# Altium schematic sheet motherboard.SchDoc
size A
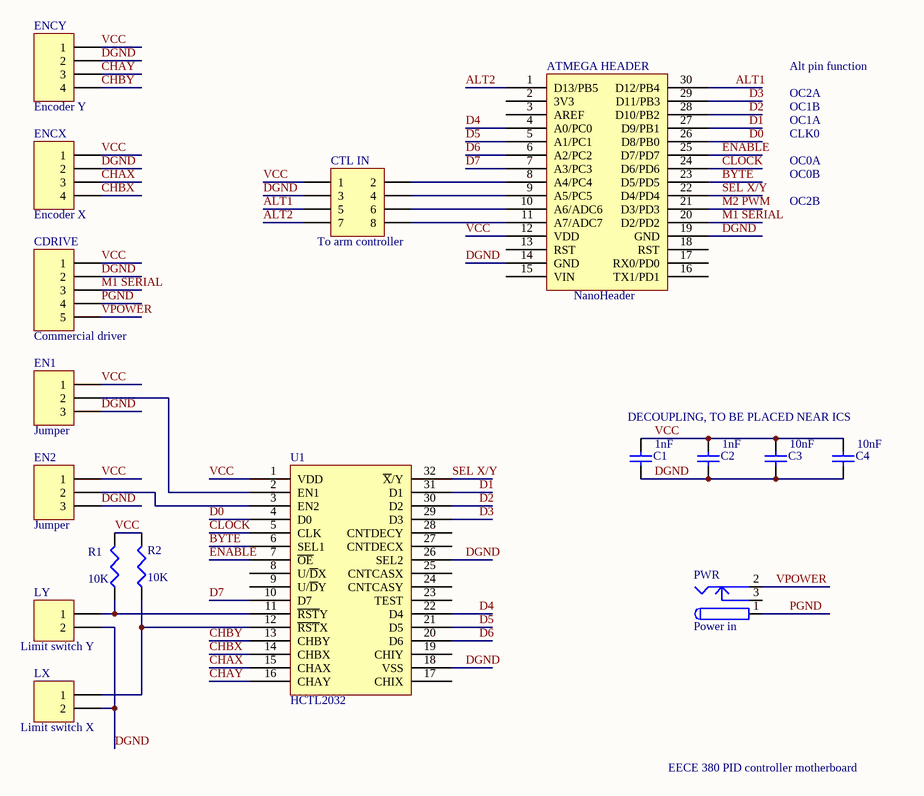
[diagram p0: motherboard.SchDoc]

## Parts
ATMEGA_HEADER  NanoHeader  [DIP30WIDE]
C1  value 1nF  [RAD-0.3]
C2  value 1nF  [RAD-0.3]
C3  value 10nF  [RAD-0.3]
C4  value 10nF  [RAD-0.3]
CDRIVE  Commercial driver  [HDR1X5_LGE1.0]
CTL_IN  To arm controller  [HDR2X4_LGE1.0]
EN1  Jumper  [HDR1X3_LGE1.0]
EN2  Jumper  [HDR1X3_LGE1.0]
ENCX  Encoder X  [HDR1X4_LGE1.0]
ENCY  Encoder Y  [HDR1X4_LGE1.0]
LX  Limit switch X  [HDR1X2_LGE1.0]
LY  Limit switch Y  [HDR1X2_LGE1.0]
PWR  Power in  [KLD_XLGE1.2]
R1  value 10K  [Res10mm_LGE1.0]
R2  value 10K  [Res10mm_LGE1.0]
U1  HCTL2032  [SOIC50P295X100-32L16N]

## Nets
ALT1: ATMEGA_HEADER.30(D12/PB4) CTL_IN.5
ALT2: ATMEGA_HEADER.1(D13/PB5) CTL_IN.7
BYTE: ATMEGA_HEADER.23(D5/PD5) U1.6(SEL1)
CHAX: ENCX.3 U1.15(CHAX)
CHAY: ENCY.3 U1.16(CHAY)
CHBX: ENCX.4 U1.14(CHBX)
CHBY: ENCY.4 U1.13(CHBY)
CLOCK: ATMEGA_HEADER.24(D6/PD6) U1.5(CLK)
D0: ATMEGA_HEADER.26(D8/PB0) U1.4(D0)
D1: ATMEGA_HEADER.27(D9/PB1) U1.31(D1)
D2: ATMEGA_HEADER.28(D10/PB2) U1.30(D2)
D3: ATMEGA_HEADER.29(D11/PB3) U1.29(D3)
D4: ATMEGA_HEADER.4(A0/PC0) U1.22(D4)
D5: ATMEGA_HEADER.5(A1/PC1) U1.21(D5)
D6: ATMEGA_HEADER.6(A2/PC2) U1.20(D6)
D7: ATMEGA_HEADER.7(A3/PC3) U1.10(D7)
DGND: ATMEGA_HEADER.14(GND) ATMEGA_HEADER.19(GND) C1.1 C2.1 C3.1 C4.1 CDRIVE.2 CTL_IN.3 EN1.3 EN2.3 ENCX.2 ENCY.2 LX.2 LY.2 U1.18(VSS) U1.26(SEL2)
ENABLE: ATMEGA_HEADER.25(D7/PD7) U1.7(~{OE})
M1 SERIAL: ATMEGA_HEADER.20(D2/PD2) CDRIVE.3
M2 PWM: ATMEGA_HEADER.21(D3/PD3)
PGND: CDRIVE.4 PWR.1
SEL X/Y: ATMEGA_HEADER.22(D4/PD4) U1.32(~{X}/Y)
VCC: ATMEGA_HEADER.12(VDD) C1.2 C2.2 C3.2 C4.2 CDRIVE.1 CTL_IN.1 EN1.1 EN2.1 ENCX.1 ENCY.1 R1.2 R2.2 U1.1(VDD)
VPOWER: CDRIVE.5 PWR.2
NetATMEGA_HEADER_8: ATMEGA_HEADER.8(A4/PC4) CTL_IN.2
NetATMEGA_HEADER_9: ATMEGA_HEADER.9(A5/PC5) CTL_IN.4
NetATMEGA_HEADER_10: ATMEGA_HEADER.10(A6/ADC6) CTL_IN.6
NetATMEGA_HEADER_11: ATMEGA_HEADER.11(A7/ADC7) CTL_IN.8
NetEN1_2: EN1.2 U1.2(EN1)
NetEN2_2: EN2.2 U1.3(EN2)
NetLX_1: LX.1 R2.1 U1.12(~{RST}X)
NetLY_1: LY.1 R1.1 U1.11(~{RST}Y)

Not connected (* = marked no-connect by the designer): ATMEGA_HEADER 2(3V3) 3(AREF) 13(RST) 15(VIN) 16(TX1/PD1) 17(RX0/PD0) 18(RST); PWR 3; U1 8(U/~{D}X) 9(U/~{D}Y) 17(CHIX) 19(CHIY) 23(TEST) 24(CNTCASY) 25(CNTCASX) 27(CNTDECX) 28(CNTDECY)

## Notes on the sheet
- OC2A
- Alt pin function
- OC0A
- CLK0
- OC1A
- OC1B
- OC0B
- OC2B
- DECOUPLING, TO BE PLACED NEAR ICS
- EECE 380 PID controller motherboard

## Library data of the parts
C1-C4 = Cap: Capacitor; Published: 8-Jun-2000; LatestRevisionDate: 17-Jul-2002; LatestRevisionNote: Re-released for DXP Platform.; PackageReference: RAD-0.3; Publisher: Altium Limited; PackageDescription: Radial Cap, Thru-Hole; 2 Leads; 0.3 in Pin Spacing
CDRIVE = C-Hdr1x5: Header, 6-Pin; LatestRevisionDate: 17-Jul-2002; LatestRevisionNote: Re-released for DXP Platform.; Publisher: Altium Limited
CTL_IN = C-Hdr2x4: Header, 4-Pin, Dual row; LatestRevisionDate: 17-Jul-2002; LatestRevisionNote: Re-released for DXP Platform.; Publisher: Altium Limited
EN1 EN2 = C-Hdr1x3: Header, 4-Pin; LatestRevisionDate: 17-Jul-2002; LatestRevisionNote: Re-released for DXP Platform.; Publisher: Altium Limited
ENCX ENCY = C-Hdr1x4: Header, 4-Pin; LatestRevisionDate: 17-Jul-2002; LatestRevisionNote: Re-released for DXP Platform.; Publisher: Altium Limited
LX LY = C-Hdr1x2: Header, 2-Pin; LatestRevisionDate: 17-Jul-2002; LatestRevisionNote: Re-released for DXP Platform.; Publisher: Altium Limited
PWR = Power in: Low Voltage Power Supply Connector; Published: 17-Dec-2003; DatasheetDocument: 09-May-2002; Publisher: Altium Limited; ComponentLink1Description: Manufacturer Link; ComponentLink1URL: http://domino.kycon.com/internet/Products.html
R1 R2 = G-Res: resistor (specify value); Published: 8-Jun-2000; LatestRevisionDate: 29-May-2009; LatestRevisionNote: IPC-7351 Footprint Added.; PackageReference: J1-0603; Publisher: Altium Limited; PackageDescription: Chip Resistor